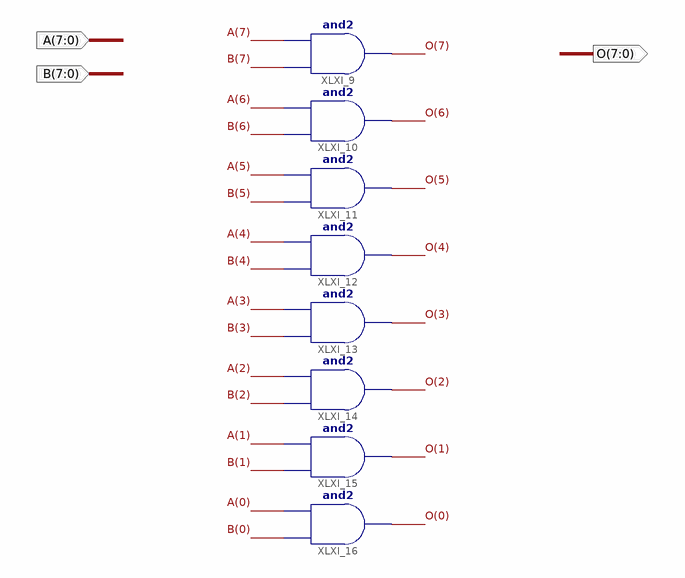
[diagram p0: schematic sheet 1]
// Xilinx ISE schematic bitAND.sch (spartan6) as structural Verilog: 8 symbols, 3 ports
module bitAND (
  input  [7:0] A,
  input  [7:0] B,
  output [7:0] O
);

  and XLXI_9 (O[7], B[7], A[7]);
  and XLXI_10 (O[6], B[6], A[6]);
  and XLXI_11 (O[5], B[5], A[5]);
  and XLXI_12 (O[4], B[4], A[4]);
  and XLXI_13 (O[3], B[3], A[3]);
  and XLXI_14 (O[2], B[2], A[2]);
  and XLXI_15 (O[1], B[1], A[1]);
  and XLXI_16 (O[0], B[0], A[0]);
endmodule
